# EAGLE design dss_smd (EAGLE 9.6.2)
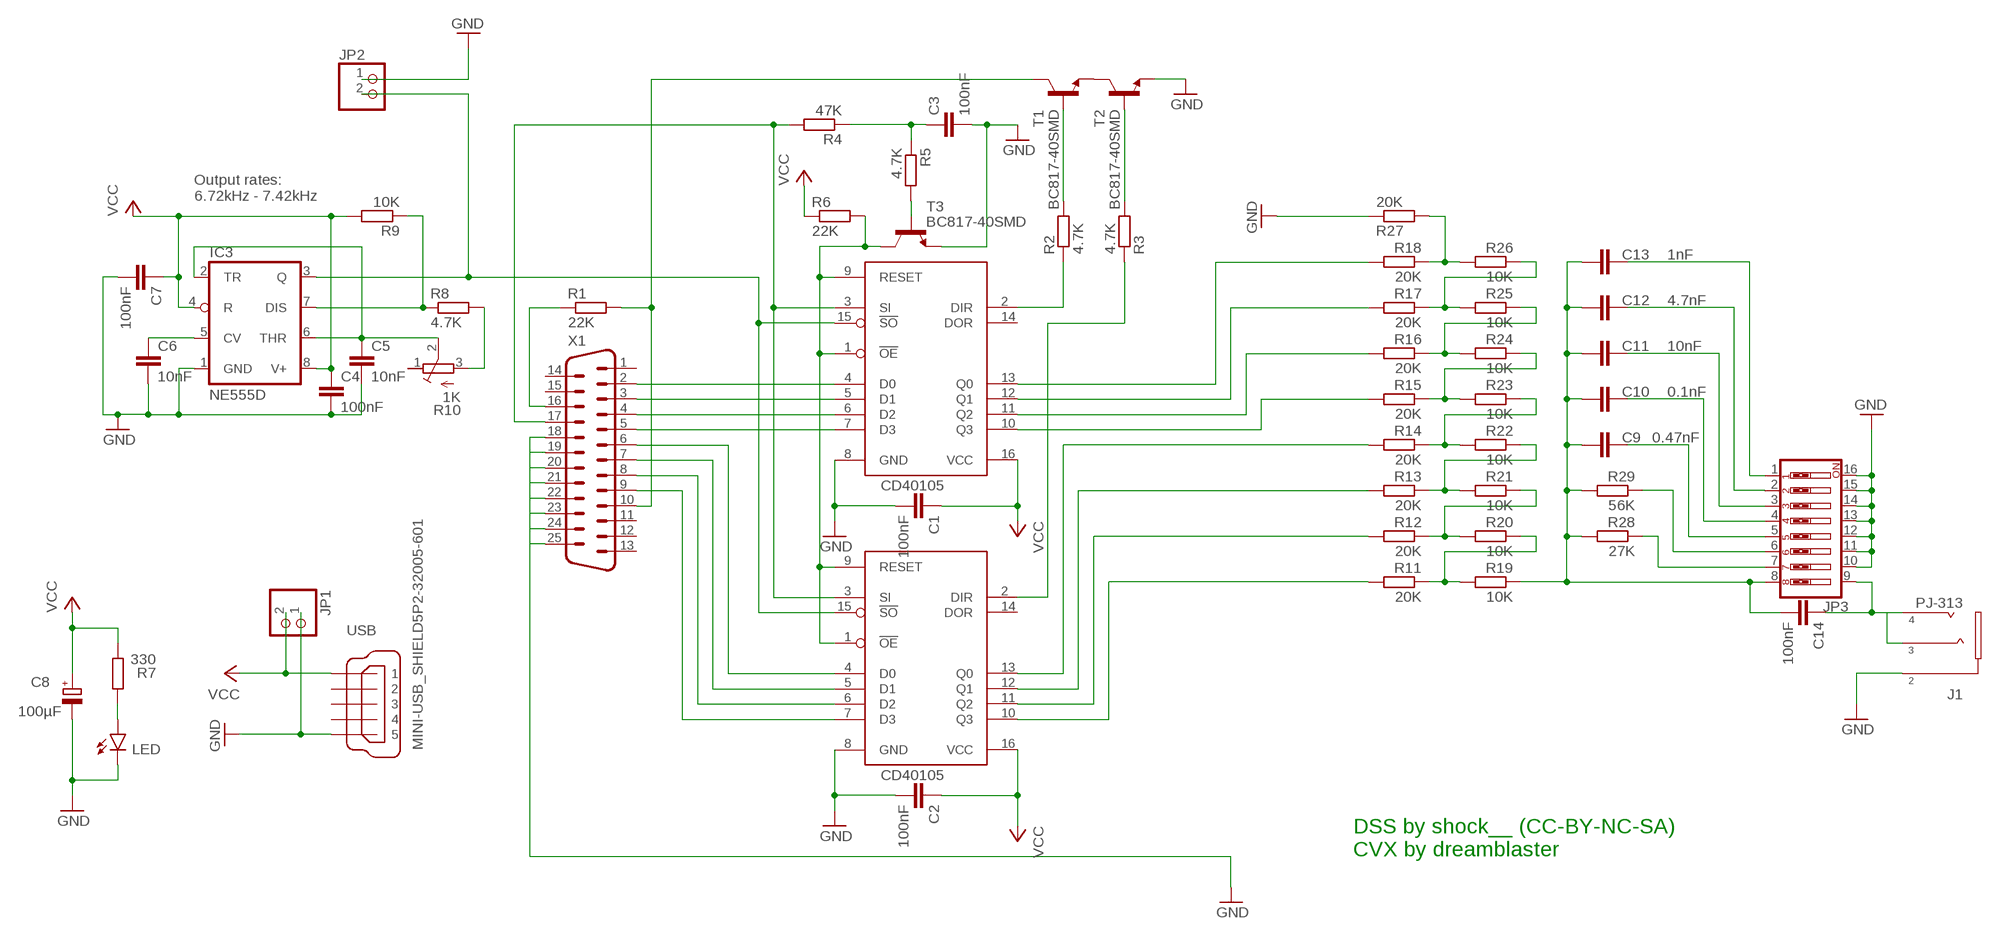
[diagram p0: schematic, sheet 1]

## Parts
C1  100nF  C-EUC0805  [C0805]
C2  100nF  C-EUC0805K  [C0805K]
C3  100nF  C-EUC0805K  [C0805K]
C4  100nF  C-EUC0805K  [C0805K]
C5  10nF  C-EUC0805K  [C0805K]
C6  10nF  C-EUC0805K  [C0805K]
C7  100nF  C-EUC0805K  [C0805K]
C8  100µF  CPOL-EUB  [PANASONIC_B]
C9  0.47nF  C-EUC0805K  [C0805K]
C10  0.1nF  C-EUC0805K  [C0805K]
C11  10nF  C-EUC0805K  [C0805K]
C12  4.7nF  C-EUC0805K  [C0805K]
C13  1nF  C-EUC0805K  [C0805K]
C14  100nF  C-EUC0805K  [C0805K]
IC1  CD40105  [DIL16]
IC2  CD40105  [DIL16]
IC3  NE555D  [SO08]
J1  PJ-313  [PJ-313]
JP1  PINHD-1X2  [1X02]
JP2  PINHD-1X2  [1X02]
JP3  SW_DIP-8  [EDG-08]
LED  LEDCHIP-LED0805  [CHIP-LED0805]
R1  22K  R-EU_R0805  [R0805]
R2  4.7K  R-EU_R0805  [R0805]
R3  4.7K  R-EU_R0805  [R0805]
R4  47K  R-EU_R0805  [R0805]
R5  4.7K  R-EU_R0805  [R0805]
R6  22K  R-EU_R0805  [R0805]
R7  330  R-EU_R0805  [R0805]
R8  4.7K  R-EU_R0805  [R0805]
R9  10K  R-EU_R0805  [R0805]
R10  1K  R-TRIMMT93YA  [RTRIMT93YA]
R11  20K  R-EU_R0805  [R0805]
R12  20K  R-EU_R0805  [R0805]
R13  20K  R-EU_R0805  [R0805]
R14  20K  R-EU_R0805  [R0805]
R15  20K  R-EU_R0805  [R0805]
R16  20K  R-EU_R0805  [R0805]
R17  20K  R-EU_R0805  [R0805]
R18  20K  R-EU_R0805  [R0805]
R19  10K  R-EU_R0805  [R0805]
R20  10K  R-EU_R0805  [R0805]
R21  10K  R-EU_R0805  [R0805]
R22  10K  R-EU_R0805  [R0805]
R23  10K  R-EU_R0805  [R0805]
R24  10K  R-EU_R0805  [R0805]
R25  10K  R-EU_R0805  [R0805]
R26  10K  R-EU_R0805  [R0805]
R27  20K  R-EU_R0805  [R0805]
R28  27K  R-EU_R0805  [R0805]
R29  56K  R-EU_R0805  [R0805]
T1  BC817-40SMD  [SOT23-BEC]
T2  BC817-40SMD  [SOT23-BEC]
T3  BC817-40SMD  [SOT23-BEC]
USB  MINI-USB_SHIELD5P2-32005-601  [32005-601]
X1  HS-LU_M25K  [HS-LU_M25K]

## Nets
!FULL_1: IC1.2(DIR) R2.1
!FULL_2: IC2.2(DIR) R3.1
CLK_IN: IC1.3(SI) IC2.3(SI) R4.2 X1.17
FULL: R1.2 T1.C X1.10
GND: C1.2 C2.2 C3.2 C4.2 C5.2 C6.2 C7.2 C8.- IC1.8(GND) IC2.8(GND) IC3.1(GND) J1.2_1 J1.2_2 JP1.1 JP2.1 JP3.10 JP3.11 JP3.12 JP3.13 JP3.14 JP3.15 JP3.16 LED.C R27.1 T2.E T3.E USB.5 X1.24 X1.25
N$1: IC1.4(D0) X1.2
N$2: IC1.5(D1) X1.3
N$3: IC1.6(D2) X1.4
N$4: IC1.7(D3) X1.5
N$5: IC2.4(D0) X1.6
N$6: IC2.5(D1) X1.7
N$7: IC2.6(D2) X1.8
N$8: IC2.7(D3) X1.9
N$10: IC1.12(Q1) R17.2
N$11: IC1.11(Q2) R16.2
N$12: IC1.10(Q3) R15.2
N$13: IC2.13(Q0) R14.2
N$14: IC2.12(Q1) R13.2
N$15: IC2.11(Q2) R12.2
N$16: IC2.10(Q3) R11.2
N$17: IC1.15(!SO) IC2.15(!SO) IC3.3(Q) JP2.2
N$18: C6.1 IC3.5(CV)
N$19: R1.1 X1.16
N$20: IC3.7(DIS) R8.1 R9.1
N$21: C5.1 IC3.2(TR) IC3.6(THR) R10.2(S)
N$22: R2.2 T1.B
N$23: R8.2 R10.3(A)
N$24: R3.2 T2.B
N$25: C3.1 R4.1 R5.1
N$26: R5.2 T3.B
N$27: LED.A R7.2
N$28: T1.E T2.C
N$29: R18.1 R26.2 R27.2
N$30: R17.1 R25.2 R26.1
N$31: R16.1 R24.2 R25.1
N$32: R15.1 R23.2 R24.1
N$33: R14.1 R22.2 R23.1
N$34: R13.1 R21.2 R22.1
N$35: R12.1 R20.2 R21.1
N$36: R11.1 R19.2 R20.1
N$37: C9.2 C10.2 C11.2 C12.2 C13.2 C14.2 JP3.8 R19.1 R28.2 R29.2
N$38: JP3.7 R28.1
N$39: IC1.13(Q0) R18.2
N$48: C14.1 J1.3 J1.4_1 J1.4_2 JP3.9
N$49: JP3.6 R29.1
N$50: C9.1 JP3.5
N$51: C10.1 JP3.4
N$52: C11.1 JP3.3
N$53: C12.1 JP3.2
N$54: C13.1 JP3.1
N$55: X1.20
N$56: X1.19
N$58: X1.21
N$59: X1.22
N$60: X1.18
N$61: X1.23
RESET: IC1.1(!OE) IC1.9(RESET) IC2.1(!OE) IC2.9(RESET) R6.2 T3.C
VCC: C1.1 C2.1 C4.1 C7.1 C8.+ IC1.16(VCC) IC2.16(VCC) IC3.4(R) IC3.8(V+) JP1.2 R6.1 R7.1 R9.2 USB.1
Unconnected: IC1.14(DOR) IC2.14(DOR) R10.1(E) USB.2 USB.3 USB.4 USB.M1(S1) USB.M2(S2) X1.1 X1.11 X1.12 X1.13 X1.14 X1.15

## Notes on the sheet
- Output rates:
  6.72kHz - 7.42kHz
- DSS by shock__ (CC-BY-NC-SA)
  CVX by dreamblaster

## Library data of the parts
C1-C7 C9-C14 = rcl:C-EU: CAPACITOR, European symbol; SPICEPREFIX: C
C8 = rcl:CPOL-EU: POLARIZED CAPACITOR, European symbol; SPICEPREFIX: C
IC1 IC2 = fifo:CD40105: CD40105 16 x 4 bit FIFO
IC3 = linear:*555: TIMER
J1 = klinke:PJ-313: 3.5mm jack description Brover Geldrop MK
JP1 JP2 = pinheada:PINHD-1X2: PIN HEADER
JP3 = special:SW_DIP-8: DIP SWITCH
LED = led:LED: LED OSRAM: - CHIPLED LG R971, LG N971, LY N971, LG Q971, LY Q971, LO R971, LY R971 LH N974, LH R974 LS Q976, LO Q976, LY Q976 LO Q996 - Hyper CHIPLED LW Q18S LB Q993, LB Q99A, LB R99A - SideLED LS A670, LO A670, LY A670, LG A670, LP A670 LB A673, LV A673, LT A673, LW A673 LH A674 LY A675 LS A676, LA A676, LO A676, LY A676, LW A676 LS A679, LY A679, LG A679 - Hyper Micro SIDELED® LS Y876, LA Y876, LO Y876, LY Y876 LT Y87S - SmartLED LW L88C, LW L88S LB L89C, LB L89S, LG L890 LS L89K, LO L89K, LY L89K LS L896, LA L896, LO L896, LY L896 - TOPLED LS T670, LO T670, LY T670, LG T670, LP T670 LSG T670, LSP T670, LSY T670, LOP T670, LYG T670 LG T671, LOG T671, LSG T671 LB T673, LV T673, LT T673, LW T673 LH T674 LS T676, LA T676, LO T676, LY T676, LB T676, LH T676, LSB T676, LW T676 LB T67C, LV T67C, LT T67C, LS T67K, LO T67K, LY T67K, LW E67C LS E67B, LA E67B, LO E67B, LY E67B, LB E67C, LV E67C, LT E67C LW T67C LS T679, LY T679, LG T679 LS T770, LO T770, LY T770, LG T770, LP T770 LB T773, LV T773, LT T773, LW T773 LH T774 LS E675, LA E675, LY E675, LS T675 LS T776, LA T776, LO T776, LY T776, LB T776 LHGB T686 LT T68C, LB T68C - Hyper Mini TOPLED® LB M676 - Mini TOPLED Santana® LG M470 LS M47K, LO M47K, LY M47K Source: http://www.osram.convergy.de LUXEON: - LUMILED® LXK2-PW12-R00, LXK2-PW12-S00, LXK2-PW14-U00, LXK2-PW14-V00 LXK2-PM12-R00, LXK2-PM12-S00, LXK2-PM14-U00 LXK2-PE12-Q00, LXK2-PE12-R00, LXK2-PE12-S00, LXK2-PE14-T00, LXK2-PE14-U00 LXK2-PB12-K00, LXK2-PB12-L00, LXK2-PB12-M00, LXK2-PB14-N00, LXK2-PB14-P00, LXK2-PB14-Q00 LXK2-PR12-L00, LXK2-PR12-M00, LXK2-PR14-Q00, LXK2-PR14-R00 LXK2-PD12-Q00, LXK2-PD12-R00, LXK2-PD12-S00 LXK2-PH12-R00, LXK2-PH12-S00 LXK2-PL12-P00, LXK2-PL12-Q00, LXK2-PL12-R00 Source: www.luxeon.com KINGBRIGHT: KA-3528ASYC Source: www.kingbright.com
R1-R9 R11-R29 = rcl:R-EU_: RESISTOR, European symbol; SPICEPREFIX: R
R10 = rcl:R-TRIMM: Trimm resistor
T1-T3 = transistor-npn:BC817*: NPN Transistor
USB = con-cypressindustries:MINI-USB_SHIELD5P2-: MINI USB-B R/A DIP 5pol. Source: www.cypressindustries.com; OC_FARNELL: unknown; OC_NEWARK: unknown
X1 = untitled:HS-LU_M25: SubD-Buchse korrigiert und verschönert Kantenmontage Reichelt D-SUB ST 25 0,14€

## Board
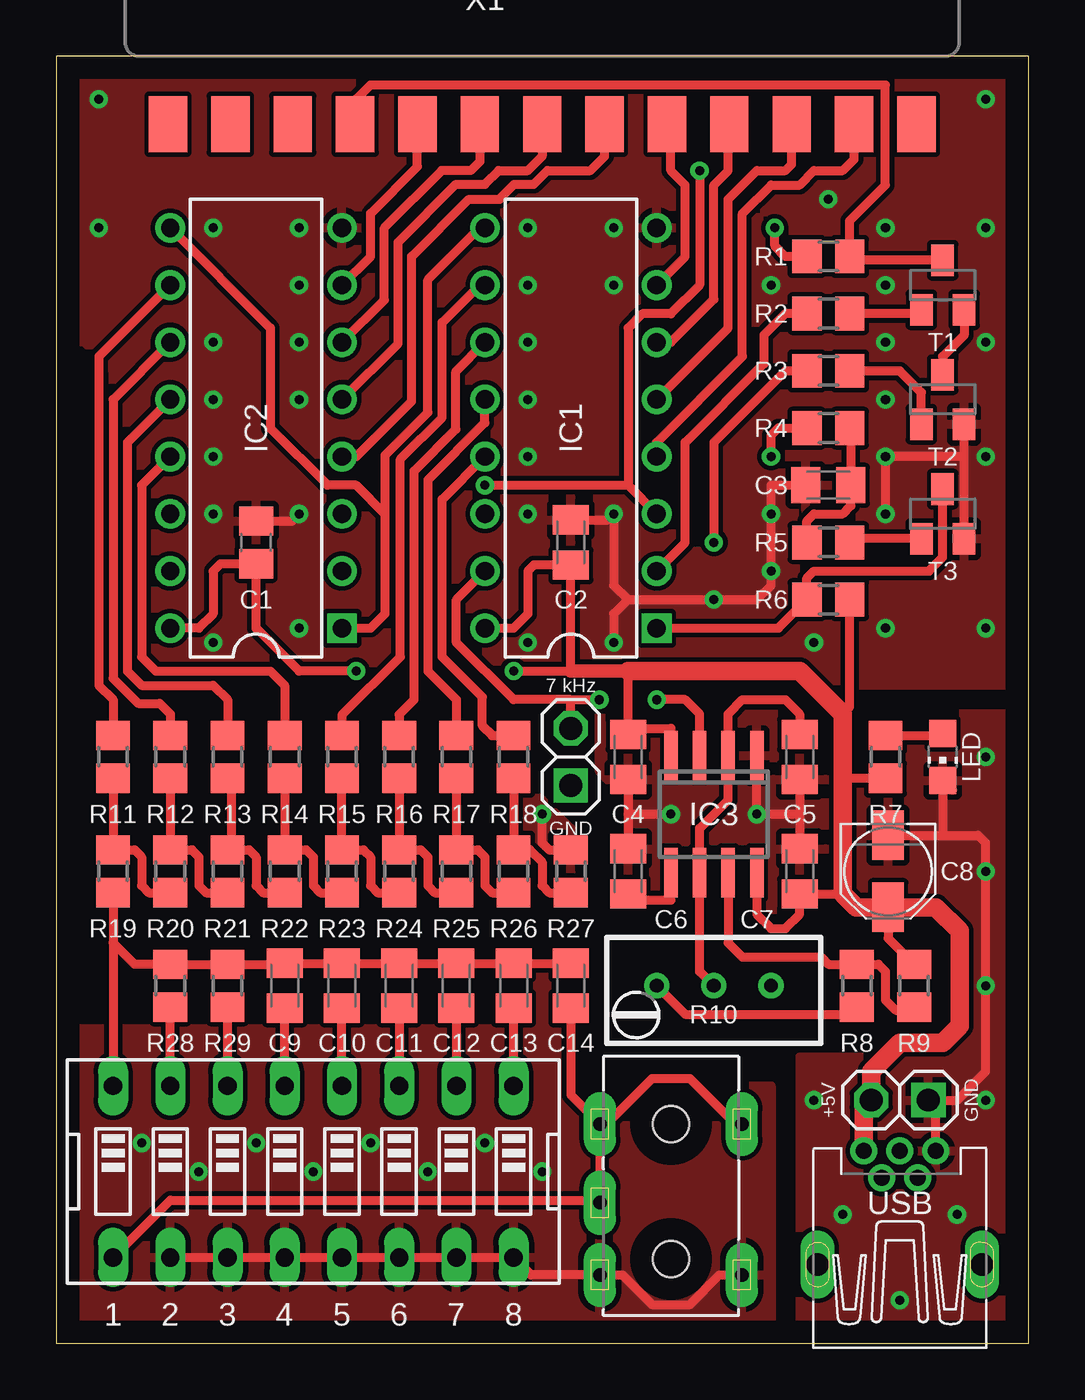
[diagram p1: board, top side]
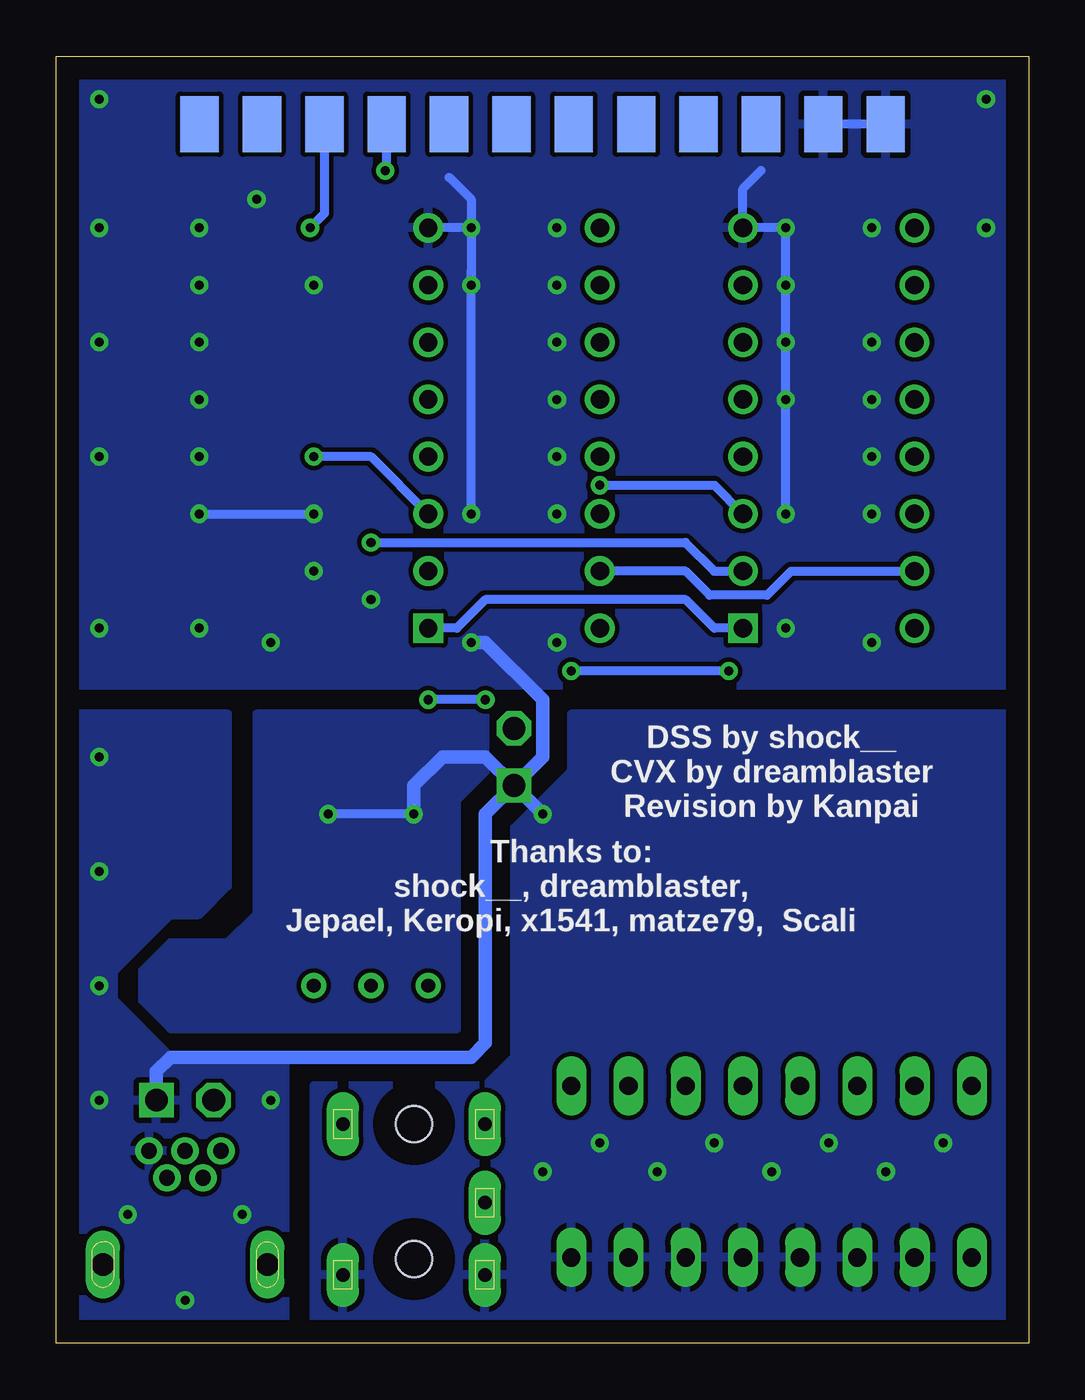
[diagram p2: board, bottom side, seen from below]

Size 43.16 x 57.15 mm. Coordinates in mm from the lower left corner, seen from the top.
Outline: 43.16,57.15 0,57.15 0,0 43.16,0 43.16,57.15
Copper layers (1*16): Top 0.035mm / dielectric 1.5mm / Bottom 0.035mm
Design rules "default *": minimum track width 8mil, minimum drill 15mil, track to track 8mil, track to pad 8mil, pad to pad 8mil, via to via 8mil, smd to smd 8mil, copper to edge 40mil, drill to drill 19mil, minimum pad ring 10mil, minimum via ring 8mil, stop-mask expansion 4mil, vias tented up to drill 24mil, thermal gap 10mil

### Footprints (pad centres in the part's own frame; a part is rotated, then mirrored left to right if it is on the bottom)
C0805 = smd 1.3 x 1.5: 1 -0.95,0; 2 0.95,0
C0805K = smd 1.3 x 1.6: 1 -1,0; 2 1,0
PANASONIC_B = smd 2.2 x 1.4: + 1.6,0; - -1.6,0
DIL16 = drill 0.813 square: 1 -8.89,-3.81 | drill 0.813: 2 -6.35,-3.81; 3 -3.81,-3.81; 4 -1.27,-3.81; 5 1.27,-3.81; 6 3.81,-3.81; 7 6.35,-3.81; 8 8.89,-3.81; 9 8.89,3.81; 10 6.35,3.81; 11 3.81,3.81; 12 1.27,3.81; 13 -1.27,3.81; 14 -3.81,3.81; 15 -6.35,3.81; 16 -8.89,3.81
SO08 = smd 0.6 x 2.2: 1 -1.905,-2.6; 2 -0.635,-2.6; 3 0.635,-2.6; 4 1.905,-2.6; 5 1.905,2.6; 6 0.635,2.6; 7 -0.635,2.6; 8 -1.905,2.6
PJ-313 = drill 0.6 pad 1.422 long: 2_1 -3.95,3.15; 2_2 -3.95,-3.15; 3 -0.75,3.15; 4_1 2.75,3.15; 4_2 2.75,-3.15 | hole 1.6: -3.25,0; 2.75,0
1X02 = drill 1.016 square: 1 -1.27,0 | drill 1.016 octagon: 2 1.27,0
EDG-08 = drill 0.813 long: 1 -8.89,-3.81; 2 -6.35,-3.81; 3 -3.81,-3.81; 4 -1.27,-3.81; 5 1.27,-3.81; 6 3.81,-3.81; 7 6.35,-3.81; 8 8.89,-3.81; 9 8.89,3.81; 10 6.35,3.81; 11 3.81,3.81; 12 1.27,3.81; 13 -1.27,3.81; 14 -3.81,3.81; 15 -6.35,3.81; 16 -8.89,3.81
CHIP-LED0805 = smd 1.2 x 1.2: A 0,-1.05; C 0,1.05
R0805 = smd 1.3 x 1.5: 1 -0.95,0; 2 0.95,0
RTRIMT93YA = drill 0.61: 1 0,-2.54; 2 0,0; 3 0,2.54
SOT23-BEC = smd 1 x 1.4: B -0.95,-1.1; C 0,1.1; E 0.95,-1.1
32005-601 = drill 0.7 pad 1.016: 1 2.825,1.6; 2 1.625,0.8; 3 2.825,0; 4 1.625,-0.8; 5 2.825,-1.6 | drill 1 pad 1.422 long: M1 -2.225,3.65; M2 -2.225,-3.65
HS-LU_M25K = smd 1.7 x 2.5: 1 16.612,-1.75; 2 13.843,-1.75; 3 11.074,-1.75; 4 8.306,-1.75; 5 5.537,-1.75; 6 2.769,-1.75; 7 0,-1.75; 8 -2.769,-1.75; 9 -5.537,-1.75; 10 -8.306,-1.75; 11 -11.074,-1.75; 12 -13.843,-1.75; 13 -16.612,-1.75 | smd 1.7 x 2.5 bottom: 14 15.227,-1.75; 15 12.459,-1.75; 16 9.69,-1.75; 17 6.921,-1.75; 18 4.153,-1.75; 19 1.384,-1.75; 20 -1.384,-1.75; 21 -4.153,-1.75; 22 -6.921,-1.75; 23 -9.69,-1.75; 24 -12.459,-1.75; 25 -15.227,-1.75

### Placement (x,y rotation side)
C1  8.87,35.56 90 top
C2  22.84,35.56 90 top
C3  34.27,38.1 180 top
C4  25.38,26.04 270 top
C5  33,26.04 270 top
C6  25.38,20.96 90 top
C7  33,20.96 90 top
C8  36.92,20.96 270 top
C9  10.14,15.88 90 top
C10  12.68,15.88 90 top
C11  15.22,15.88 90 top
C12  17.76,15.88 90 top
C13  20.3,15.88 90 top
C14  22.84,15.88 90 top
IC1  22.84,40.64 90 top
IC2  8.87,40.64 90 top
IC3  29.19,23.5 180 top
J1  27.29,6.99 90 top
JP1  37.45,10.8 180 top
JP2  22.84,26.04 90 top
JP3  11.41,7.62 180 top
LED  39.35,26.04 180 top
R1  34.27,48.26 0 top
R2  34.27,45.72 0 top
R3  34.27,43.18 0 top
R4  34.27,40.64 180 top
R5  34.27,35.56 0 top
R6  34.27,33.02 180 top
R7  36.81,26.04 90 top
R8  35.54,15.88 270 top
R9  38.08,15.88 90 top
R10  29.19,15.88 90 top
R11  2.52,26.04 90 top
R12  5.06,26.04 90 top
R13  7.6,26.04 90 top
R14  10.14,26.04 90 top
R15  12.68,26.04 90 top
R16  15.22,26.04 90 top
R17  17.76,26.04 90 top
R18  20.3,26.04 90 top
R19  2.52,20.96 90 top
R20  5.06,20.96 90 top
R21  7.6,20.96 90 top
R22  10.14,20.96 90 top
R23  12.68,20.96 90 top
R24  15.22,20.96 90 top
R25  17.76,20.96 90 top
R26  20.3,20.96 90 top
R27  22.84,20.96 270 top
R28  5.06,15.88 90 top
R29  7.6,15.88 90 top
T1  39.35,46.99 0 top
T2  39.35,41.91 0 top
T3  39.35,36.83 0 top
USB  37.45,5.72 90 top
X1  21.57,55.88 0 top

### Tracks (layer width: path | path; a pad name or v marks a point on that pad's centre or on a via)
!FULL_1
  Top 0.406: 33.32,45.4 R2.1 32.36,45.72 31.41,44.77 31.41,43.5 27.92,40.01 27.92,35.56 IC1.2
!FULL_2  (via drill 0.4)
  Top 0.406: 33,43.18 R3.1 32.36,43.18 29.19,40.01 v29.19,35.56
  Bottom 0.406: IC2.2 13.96,34.29 15.23,35.56 v29.19,35.56
CLK_IN  (via drill 0.4)
  Top 0.406: v31.73,39.37 31.73,40.32 32.05,40.64 R4.2 | v19.03,38.1 25.38,38.1 | v28.55,52.07 28.55,46.99 27.29,45.72 26.02,45.72 25.38,45.09 25.38,38.1 | IC1.3 25.38,38.1
  Bottom 0.406: IC2.3 13.95,38.1 v19.03,38.1 | v28.55,52.07 28.49,52.13 X1.17 | IC1.3 29.19,39.37 v31.73,39.37
FULL
  Top 0.406: T1.C 35.39,48.09 R1.2 35.22,49.85 36.81,51.44 36.81,55.88 13.95,55.88 13.32,55.25 13.32,54.18 X1.10
GND  (via drill 0.4, 0.4 pad 0.6)
  Top 0.406: C4.2 25.38,23.5 | 25.38,23.5 C6.2 | 36.81,22.67 C8.- 39.35,22.56 | USB.5 39.04,10.47 JP1.1 39.98,10.8 41.25,12.07 v41.25,15.88 v41.25,20.96 41.25,22.23 40.92,22.56 39.35,22.56 | T3.E 40.3,39.37 | 40.3,39.37 T2.E | 39.76,24.99 LED.C | IC3.1 v31.09,23.5 33,23.5 | 33,23.5 C7.2 | C6.2 24.87,21.96 | C2.2 24.48,36.56 v24.75,36.83 24.75,33.66 25.38,33.02 | 25.33,21.91 C6.2 | 25.38,23.5 v27.29,23.5 | LED.C 39.78,24.56 | LED.C 39.35,22.56 | 25.38,33.02 24.75,32.39 v24.75,31.12 | 21.89,21.91 | 21.89,21.91 21.57,22.23 v21.57,23.5 | C5.2 33,23.5 | 40.3,39.37 v36.81,39.37 v36.81,36.83 | 25.38,33.02 v29.19,33.02 31.09,33.02 31.73,33.66 v31.73,34.29 v31.73,36.83 31.73,38.1 C3.2 | C1.2 10.46,36.51 v10.78,36.83 | 21.89,21.91 R27.1 | JP3.10 JP3.11 JP3.12 JP3.13 JP3.14 JP3.15 JP3.16 21.07,3.04 J1.2_1 25.13,3.04 26.45,1.72 28.12,1.72 29.44,3.04 J1.2_2
  Bottom 0.406: X1.25 X1.24 | v27.29,23.5 v31.09,23.5 | v24.75,36.83 v24.75,46.99 | v24.75,46.99 24.75,47.63 | v36.81,36.83 v31.73,36.83 | 25.72,51.78 24.75,50.8 v24.75,49.53 | v24.75,49.53 v24.75,46.99 | v24.75,49.53 IC1.8 | v10.78,36.83 v10.78,41.91 v10.78,44.45 v10.78,46.99 v10.78,49.53 IC2.8 12.68,51.27 11.88,52.07
  Bottom 0.61: JP1.1 38.71,12.07 38.08,12.7 24.75,12.7 24.11,13.34 24.11,23.5 JP2.1 | JP2.1 24.11,26.04 26.02,26.04 27.29,24.77 v27.29,23.5 | JP2.1 v21.57,23.5 | JP2.1 21.57,26.04 21.57,28.58 24.11,31.12 v24.75,31.12
  other vias: 33.63,10.8 34.9,5.72 37.45,1.91 39.98,5.72 41.25,10.8 41.25,26.04 33.63,31.12 36.81,41.91 36.81,44.45 36.81,46.99 36.81,49.53 41.25,39.37 41.25,44.45 41.25,49.53 41.25,55.25 36.81,31.75 41.25,31.75 31.73,46.99 34.27,50.8 20.93,39.37 20.93,41.91 20.93,44.45 20.93,46.99 20.93,49.53 6.97,44.45 6.97,49.53 20.93,36.83 6.97,41.91 6.97,39.37 6.97,36.83 10.78,31.75 20.93,31.12 6.97,31.12 1.89,55.25 1.89,49.53 3.79,8.89 6.33,7.62 8.87,8.89 11.41,7.62 13.95,8.89 16.49,7.62 19.03,8.89 21.57,7.62
  pour Bottom: -0.02,29.21 43.16,29.21 43.16,57.15 -0.02,57.15
  pour Bottom: 24.11,27.94 34.27,27.94 34.27,19.05 35.54,17.78 38.08,17.78 39.35,16.51 39.35,15.24 38.08,13.97 25.38,13.97 25.38,24.13 24.11,25.4
  pour Bottom: 35.54,27.94 43.16,27.94 43.16,0 33,0 33,12.7 38.08,12.7 40.62,15.24 40.62,16.51 38.08,19.05 36.81,19.05 35.54,20.32
  pour Top: 24.11,27.94 34.27,27.94 34.27,19.05 35.54,17.78 38.08,17.78 39.35,16.51 39.35,15.24 38.08,13.97 25.38,13.97 25.38,24.13 24.11,25.4
  pour Top: 35.54,27.94 35.54,20.32 36.81,19.05 38.08,19.05 40.62,16.51 40.62,15.24 38.08,12.7 33,12.7 33,0 43.16,0 43.16,27.94
  pour Top: -0.02,57.15 43.16,57.15 43.16,29.21 2.52,29.21 2.52,43.18 1.25,44.45 -0.02,44.45
  pour Bottom: -0.02,27.94 20.3,27.94 20.3,25.4 22.84,22.86 22.84,12.7 24.11,11.43 31.73,11.43 31.73,0 -0.02,0
  pour Top: -0.02,0 -0.02,13.97 20.3,13.97 20.3,25.4 22.84,22.86 22.84,12.7 24.11,11.43 31.73,11.43 31.73,0
N$1
  Top 0.406: IC1.4 26.65,40.01 30.46,43.82 30.46,50.17 31.73,51.44 33,51.44 33.63,52.07 34.9,52.07 35.41,52.58 X1.2
N$2
  Top 0.406: IC1.5 29.82,45.09 29.82,50.8 31.09,52.07 32.36,52.07 32.64,52.35 X1.3
N$3
  Top 0.406: IC1.6 27.29,44.45 29.19,46.36 29.19,51.44 29.82,52.07 29.82,53.34 30.25,53.76 X1.4
N$4
  Top 0.406: IC1.7 27.92,48.26 27.92,51.44 27.29,52.07 27.29,53.16 27.11,53.34 X1.5
N$5
  Top 0.406: X1.6 24.34,52.71 23.7,52.07 21.8,52.07 21.19,51.46 20.32,51.46 19.66,50.8 18.32,50.8 15.78,48.26 15.78,41.83 13.32,39.37 IC2.4
N$6
  Top 0.406: IC2.5 15.17,44.4 15.17,48.9 17.73,51.46 19.03,51.46 19.64,52.07 20.93,52.07 21.57,52.71 X1.7
N$7
  Top 0.406: 18.8,53.5 X1.8 18.8,52.48 18.39,52.07 17.1,52.07 14.56,49.53 14.56,46.33 IC2.6
N$8
  Top 0.406: IC2.7 13.95,48.26 13.95,50.17 16.03,52.25 X1.9
N$10
  Top 0.406: IC1.12 19.03,40.88 16.49,38.34 16.49,29.85 17.76,28.58 R17.2
N$11
  Top 0.406: IC1.11 17.73,43.16 17.73,40.59 15.88,38.74 15.88,28.58 15.22,27.92 R16.2
N$12
  Top 0.406: IC1.10 18.79,46.99 17.12,45.32 17.12,41.11 15.27,39.25 15.27,30.48 12.68,27.89 R15.2 13,26.99
N$13
  Top 0.406: IC2.13 3.79,38.1 3.79,30.48 4.43,29.85 9.51,29.85 10.14,29.21 R14.2
N$14
  Top 0.406: IC2.12 3.15,40.01 3.15,29.85 3.79,29.21 6.97,29.21 7.6,28.58 R13.2
N$15
  Top 0.406: IC2.11 2.52,41.91 2.52,29.53 3.63,28.42 4.59,28.42 5.06,27.94 R12.2
N$16
  Top 0.406: IC2.10 1.89,43.82 1.89,29.21 2.52,28.58 R11.2
N$17  (via drill 0.4 pad 0.6)
  Top 0.406: IC1.15 17.76,33.02 17.76,31.12 20.3,28.58 22.84,28.58 | IC3.3 28.55,27.94 27.92,28.58 v26.65,28.58 | 22.84,28.58 v24.11,28.58 | JP2.2 22.84,28.58
  Bottom 0.406: IC1.15 15.22,34.29 14.15,33.22 11.6,33.22 10.54,34.29 IC2.15 | v24.11,28.58 v26.65,28.58
N$18
  Top 0.406: IC3.5 27.29,19.69 25.65,19.69 C6.1
N$19  (via drill 0.4)
  Top 0.406: R1.1 32.36,48.26 31.89,48.73 v31.89,49.53
  Bottom 0.406: X1.16 31.26,50.17 v31.89,49.53
N$20
  Top 0.406: IC3.7 29.82,17.78 30.46,17.15 33.95,17.15 34.27,16.83 R8.1 36.49,16.83 36.81,16.51 36.81,15.24 37.27,14.78 37.98,14.78 38.08,14.88 R9.1
N$21
  Top 0.406: IC3.6 28.55,20.96 | IC3.6 28.55,22.86 29.82,24.13 IC3.2 29.82,27.94 30.46,28.58 32.36,28.58 33,27.94 C5.1 | R10.2 28.55,16.51 IC3.6
N$22
  Top 0.406: T1.B 38.23,45.72 R2.2
N$23
  Top 0.406: R10.3 27.92,14.61 35.22,14.61 R8.2
N$24
  Top 0.406: T2.B 38.4,42.23 37.45,43.18 R3.2
N$25
  Top 0.406: R4.1 35.27,40.59 C3.1 | C3.1 35.43,37.94 35.43,37.67 | R5.1 33.32,36.52 33.63,36.83 34.9,36.83 35.27,37.2 C3.1
N$26
  Top 0.406: T3.B 35.39,35.73 R5.2
N$27
  Top 0.406: 37.35,26.99 R7.2 39.25,26.99 LED.A
N$28
  Top 0.406: T1.E 40.3,44.77 39.35,43.82 T2.C
N$29
  Top 0.406: R18.1 R26.2 21.03,21.91 21.57,21.36 21.57,20.32 21.89,20.01 R27.2
N$30
  Top 0.406: R25.2 18.32,21.91 | R17.1 R25.2 | R25.2 18.71,21.91 19.03,21.59 19.03,20.32 19.34,20.01 R26.1
N$31
  Top 0.406: R24.2 15.79,21.91 | R16.1 R24.2 | R24.2 16.18,21.91 16.49,21.59 16.49,20.32 16.8,20.01 R25.1
N$32
  Top 0.406: R15.1 R23.2 13.63,21.91 13.95,21.59 13.95,20.32 14.27,20.01 R24.1
N$33
  Top 0.406: R14.1 R22.2 | 10.71,21.91 R22.2 | R22.2 11.1,21.91 11.41,21.59 11.41,20.32 11.72,20.01 R23.1
N$34
  Top 0.406: R13.1 7.76,24.93 7.76,21.75 R21.2 8.55,21.91 8.87,21.59 8.87,20.32 9.19,20.01 R22.1
N$35
  Top 0.406: R12.1 R20.2 6.02,21.91 6.33,21.59 6.33,20.32 6.65,20.01 R21.1
N$36
  Top 0.406: R11.1 R19.2 3.48,21.91 3.79,21.59 3.79,20.32 4.11,20.01 R20.1
N$37
  Top 0.406: 5.01,16.88 R28.2 | R28.2 R29.2 10.09,16.83 C9.2 C10.2 C11.2 C12.2 C13.2 C14.2 | R19.1 2.52,17.78 | 2.52,17.78 JP3.8 | R28.2 3.48,16.83 2.52,17.78
N$38
  Top 0.406: JP3.7 R28.1
N$39
  Top 0.406: IC1.13 17.12,37.47 17.12,30.48 18.92,28.69 18.92,27.42 19.35,26.99 | 19.35,26.99 | 19.35,26.99 R18.2
N$48
  Top 0.406: JP3.9 5.06,6.35 24.02,6.35 J1.3 J1.4_1 | J1.4_1 22.84,11.03 C14.1 | J1.4_1 24.43,9.74 26.45,11.75 28.12,11.75 30.14,9.74 J1.4_2
N$49
  Top 0.406: JP3.6 R29.1
N$50
  Top 0.406: JP3.5 C9.1
N$51
  Top 0.406: JP3.4 C10.1
N$52
  Top 0.406: C11.1 JP3.3
N$53
  Top 0.406: C12.1 JP3.2
N$54
  Top 0.406: JP3.1 C13.1
RESET
  Top 0.406: IC1.9 18.79,49.53 16.49,47.23 16.49,41.33 14.59,39.43 14.59,36.83 | IC1.1 32.05,31.75 R6.2 33.32,33.98 33.63,34.29 38.73,34.29 39.35,34.91 T3.C 39.31,37.89 | IC2.1 13.95,31.75 14.59,32.39 14.59,36.83 | IC2.9 9.51,45.09 9.51,40.64 12.04,38.1 13.32,38.1 14.59,36.83
  Bottom 0.406: IC1.1 25.38,31.75 24.11,33.02 15.22,33.02 13.95,31.75 IC2.1
VCC  (via drill 0.4 pad 0.6)
  Top 0.406: IC2.16 6.33,31.75 6.97,32.39 6.97,34.29 7.29,34.61 C1.1 8.87,31.75 10.78,29.85 v13.32,29.85 | IC1.16 20.3,31.75 20.93,32.39 20.93,34.29 21.21,34.56 C2.1 22.84,29.85 v20.3,29.85 | IC3.8 31.09,19.05 31.73,18.42 32.36,18.42 33,19.05 C7.1 34.9,19.96 | C8.+ 36.92,18.53 | IC3.4 27.29,27.31 25.65,27.31 C4.1 25.38,29.85 | 37.45,19.36 C8.+ | R9.2 36.92,17.98 C8.+ | R7.1 35.22,25.09 34.9,24.77 | 34.9,27.94 35.22,28.26 R6.1
  Top 0.61: 25.38,29.85 22.84,29.85
  Top 0.813: USB.1 35.84,10.47 JP1.2 36.17,12.07 37.45,13.34 39.35,13.34 40.1,14.09 40.1,18.3 39.04,19.36 37.45,19.36 | C8.+ 35.5,19.36 34.9,19.96 34.9,24.77 34.9,27.94 33,29.85 25.38,29.85
  Bottom 0.406: v13.32,29.85 v20.3,29.85

### Text on the board
tPlace: 7 kHz | GND | +5V | GND
tNames: 1 | 2 | 3 | 4 | 5 | 6 | 7 | 8
bNames: DSS by shock__ / CVX by dreamblaster / Revision by Kanpai | Thanks to: / shock__, dreamblaster, / Jepael, Keropi, x1541, matze79, Scali